# Altium schematic sheet Battery.SchDoc
size A4
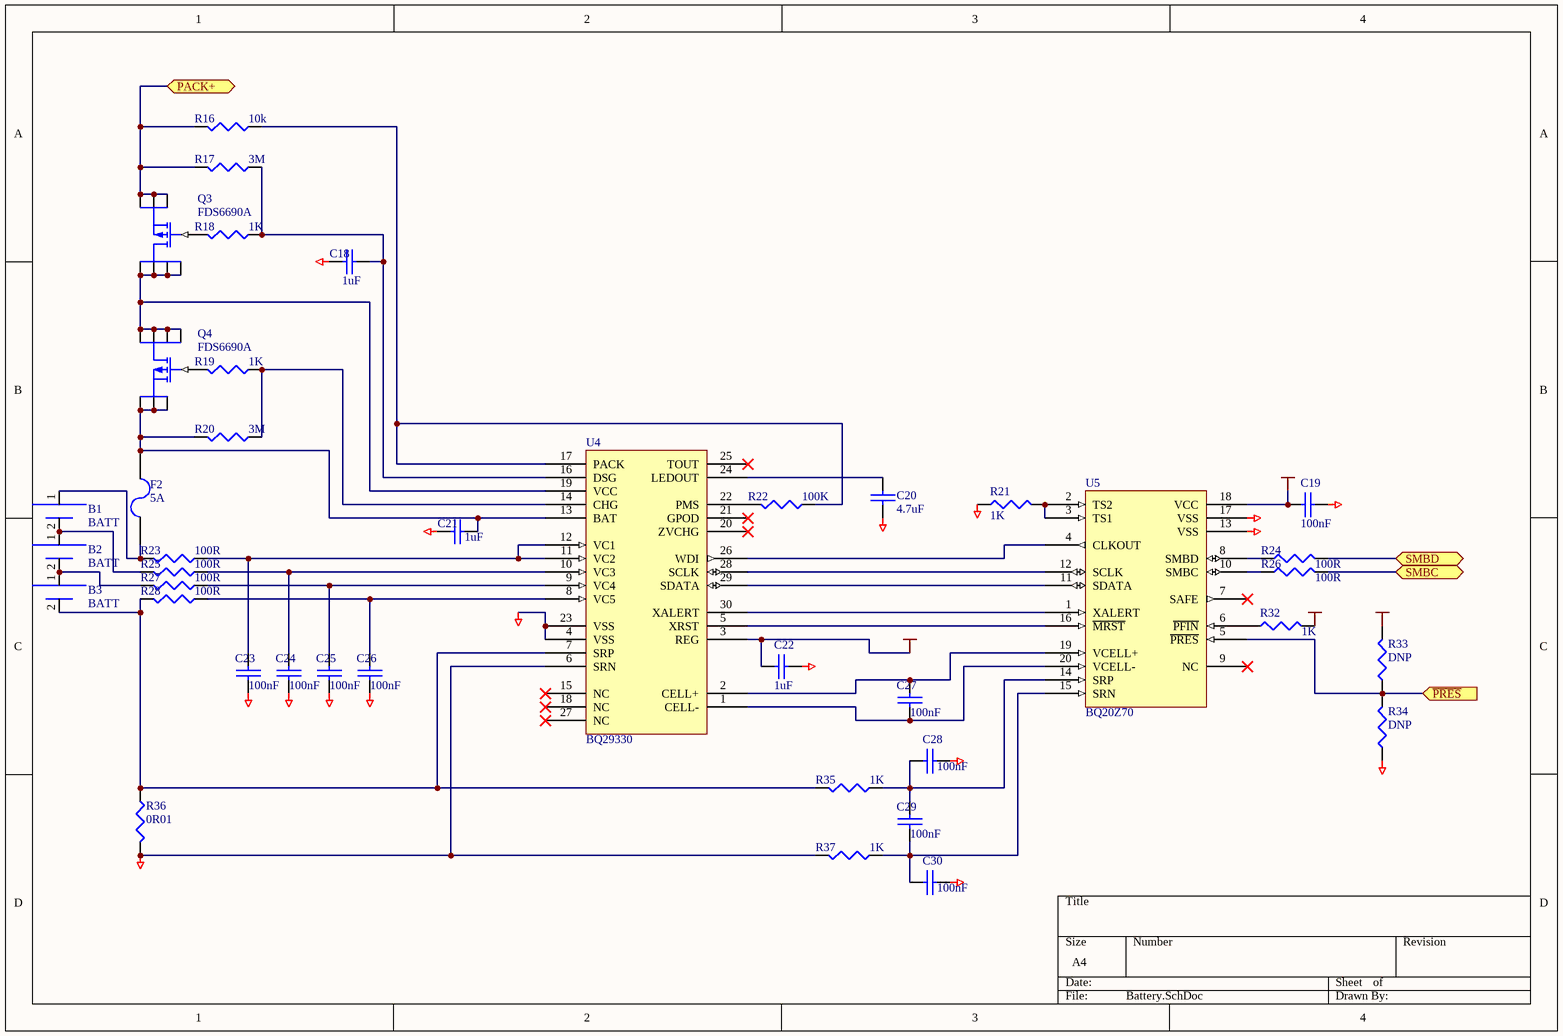
[diagram p0: Battery.SchDoc]

## Parts
B1  BATT  [StandardLiIonCell]
B2  BATT  [StandardLiIonCell]
B3  BATT  [StandardLiIonCell]
C18  1uF  [0805]
C19  100nF  [0603]
C20  4.7uF  [0805]
C21  1uF  [0805]
C22  1uF  [0805]
C23  100nF  [0603]
C24  100nF  [0603]
C25  100nF  [0603]
C26  100nF  [0603]
C27  100nF  [0603]
C28  100nF  [0603]
C29  100nF  [0603]
C30  100nF  [0603]
F2  5A  [LITTELFUSE-154]
Q3  FDS6690A  [SO8]
Q4  FDS6690A  [SO8]
R16  10k  [0603]
R17  3M  [0603]
R18  1K  [0603]
R19  1K  [0603]
R20  3M  [0603]
R21  1K  [0603]
R22  100K  [0603]
R23  100R  [0603]
R24  100R  [0603]
R25  100R  [0603]
R26  100R  [0603]
R27  100R  [0603]
R28  100R  [0603]
R32  1K  [0603]
R33  DNP  [0603]
R34  DNP  [0603]
R35  1K  [0603]
R36  0R01  [2010]
R37  1K  [0603]
U4  BQ29330  [TSSOP30]
U5  BQ20Z70  [TSSOP20]

## Ports
PACK+, SMBC (bidir), SMBD (bidir), ~{PRES} (in)

## Nets
BATT_VCC: C19.1 C22.1 R32.2 R33.2 U4.3(REG) U5.18(VCC)
GND: C18.2 C19.2 C20.2 C21.2 C22.2 C23.2 C24.2 C25.2 C26.2 C28.2 C30.2 R21.1 R34.1 R36.2 R37.2 U4.4(VSS) U4.6(SRN) U4.23(VSS) U5.13(VSS) U5.17(VSS)
~{PRES}: R33.1 R34.2 U5.5(~{PRES}) ; port ~{PRES}
PACK+: Q3.1(S) Q3.2(S) Q3.3(S) R16.2 R17.2 ; port PACK+
SMBC: R26.2 ; port SMBC
SMBD: R24.2 ; port SMBD
NetB1_1: B1.1(+) F2.1 R23.2
NetB1_2: B1.2(-) B2.1(+) R25.2
NetB2_2: B2.2(-) B3.1(+) R27.2
NetB3_2: B3.2(-) R28.2 R35.2 R36.1 U4.7(SRP)
NetC18_1: C18.1 R17.1 R18.1 U4.16(DSG)
NetC20_1: C20.1 U4.24(LEDOUT)
NetC21_1: C21.1 F2.2 Q4.1(S) Q4.2(S) Q4.3(S) R20.2 U4.13(BAT)
NetC23_1: C23.1 R23.1 U4.11(VC2) U4.12(VC1)
NetC24_1: C24.1 R25.1 U4.10(VC3)
NetC25_1: C25.1 R27.1 U4.9(VC4)
NetC26_1: C26.1 R28.1 U4.8(VC5)
NetC27_1: C27.1 U4.2(CELL+) U5.19(VCELL+)
NetC27_2: C27.2 U4.1(CELL-) U5.20(VCELL-)
NetC28_1: C28.1 C29.1 R35.1 U5.14(SRP)
NetC29_2: C29.2 C30.1 R37.1 U5.15(SRN)
NetQ3_4: Q3.4(G) R18.2
NetQ3_5: Q3.5(D) Q3.6(D) Q3.7(D) Q3.8(D) Q4.5(D) Q4.6(D) Q4.7(D) Q4.8(D) U4.19(VCC)
NetQ4_4: Q4.4(G) R19.2
NetR16_1: R16.1 R22.1 U4.17(PACK)
NetR19_1: R19.1 R20.1 U4.14(CHG)
NetR21_2: R21.2 U5.2(TS2) U5.3(TS1)
NetR22_2: R22.2 U4.22(PMS)
NetR24_1: R24.1 U5.8(SMBD)
NetR26_1: R26.1 U5.10(SMBC)
NetR32_1: R32.1 U5.6(~{PFIN})
NetU4_5: U4.5(XRST) U5.16(~{MRST})
NetU4_26: U4.26(WDI) U5.4(CLKOUT)
NetU4_28: U4.28(SCLK) U5.12(SCLK)
NetU4_29: U4.29(SDATA) U5.11(SDATA)
NetU4_30: U4.30(XALERT) U5.1(XALERT)

Not connected (* = marked no-connect by the designer): U4 15(NC)* 18(NC)* 20(ZVCHG)* 21(GPOD)* 25(TOUT)* 27(NC)*; U5 7(SAFE)* 9(NC)*

## Library data of the parts
C18 C21 C22 = CAP: Capacitor; Order#: 753-567; Price: 0.31; Supplier: Farnell
C19 C23-C30 = CAP: Capacitor; Supplier: Stock
C20 = CAP: Capacitor; Order#: 5212832; Price: 0.13; Supplier: Farnell
F2 = FUSE2: Fuse; Order#: 145-3901; Price: 7.78; Supplier: Farnell
Q3 = FDS6690A: N-type MOSFET; Order#: 9845275; Price: 2.99; Supplier: Farnell
Q4 = FDS6690A: N-type MOSFET; Supplier: Farnell
R16-R28 R32-R35 R37 = RES1: Resistor
  R16 R18 R19 R21-R28 R32-R35 R37: Supplier: Stock
  R17 R20: Supplier: Farnell
R36 = RES1: Resistor; Order#: 1100044; Price: 1.37; Supplier: Farnell
U4 = BQ29330: Supplier: TI Sample
U5 = BQ20Z70: Supplier: TI Sample